# EasyEDA Pro project AIR32_minimal_system.eprj

# Schematic Schematic1
Create Date: 2023-08-29; Page Name: P1; Project Name: AIR32_minimal_system; Schematic Name: Schematic1; Update Date: 2023-09-01; Company: 嘉立创EDA; Page Size: A4; Version: V1.0
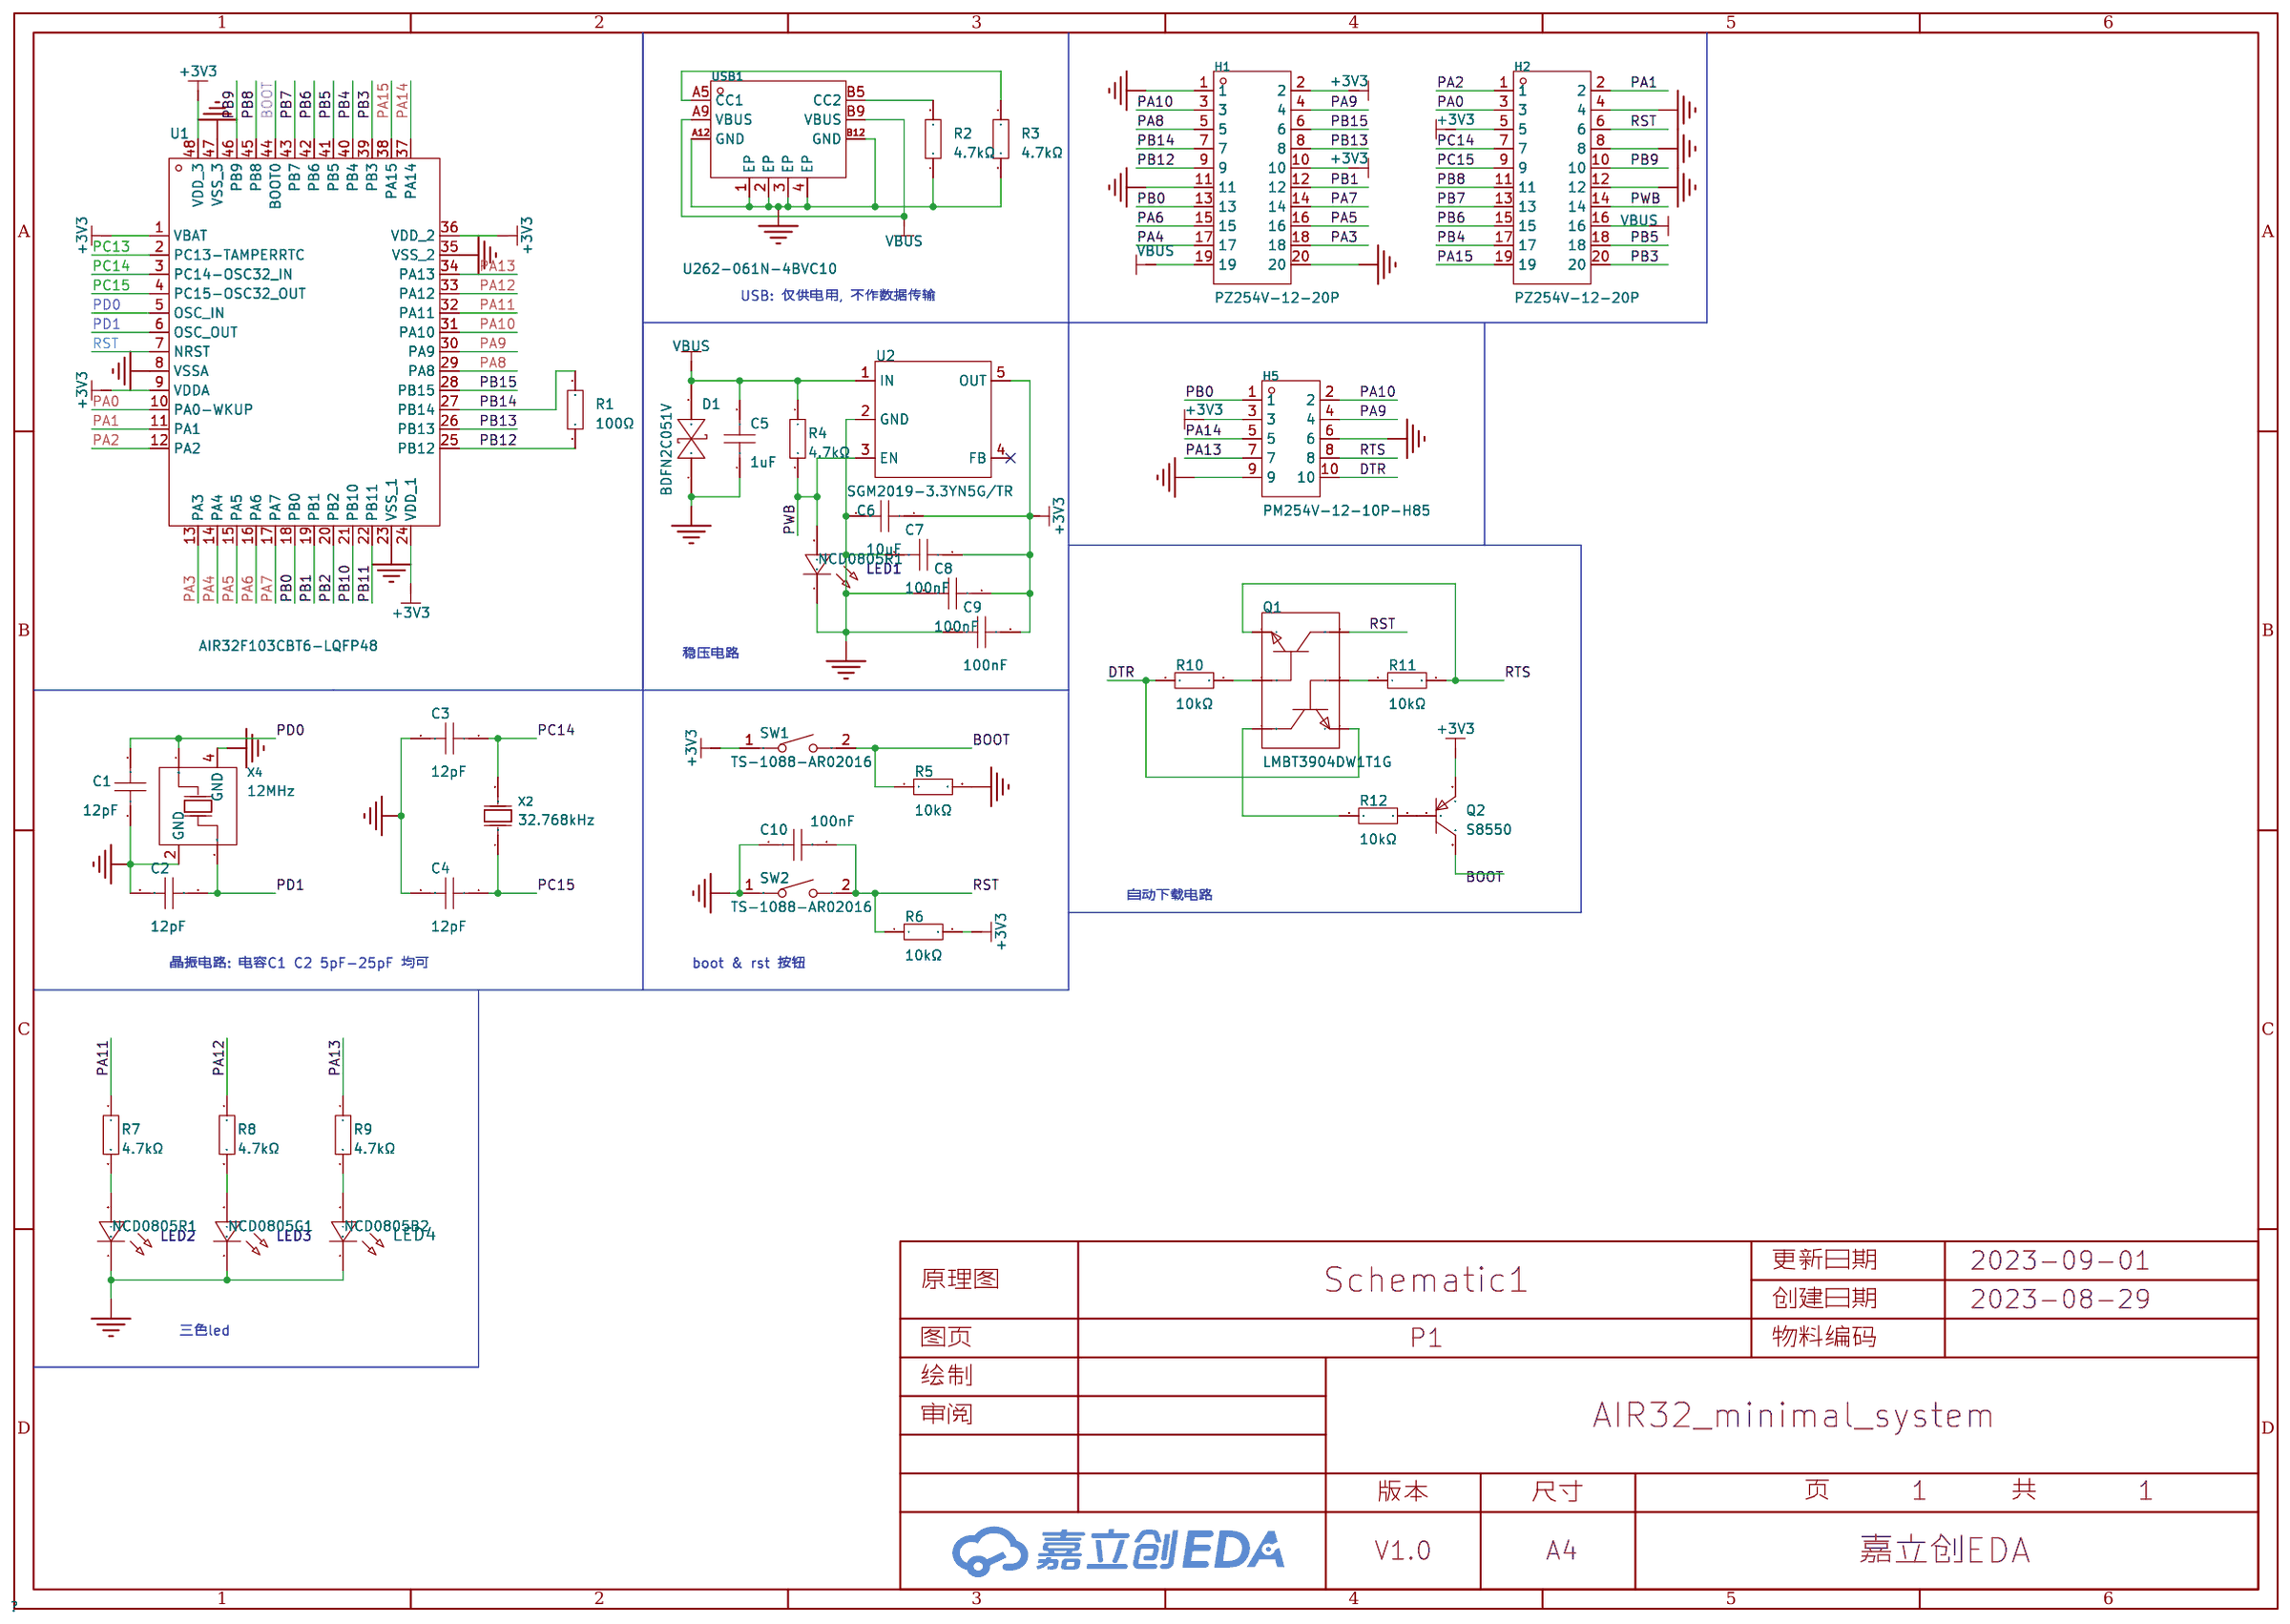
[diagram p0: schematic sheet]

## Parts
C1  12pF  [C0603]
C2  12pF  [C0603]
C3  12pF  [C0603]
C4  12pF  [C0603]
C5  1uF  [C0603]
C6  10uF  [C0603]
C7  100nF  [C0603]
C8  100nF  [C0603]
C9  100nF  [C0603]
C10  100nF  [C0603]
D1  BDFN2C051V  [X1SON-2_L1.0-W0.6-P0.65-BI]
H1  PZ254V-12-20P  [HDR-TH_20P-P2.54-V-M-R2-C10-S2.54]
H2  PZ254V-12-20P  [HDR-TH_20P-P2.54-V-M-R2-C10-S2.54]
H5  PM254V-12-10P-H85  [HDR-TH_10P-P2.54-V-F-R2-C5-S2.54]
LED1  NCD0805R1  [LED0805-RD_RED]
LED2  NCD0805R1  [LED0805-RD_RED]
LED3  NCD0805G1  [LED0805-R-RD]
LED4  NCD0805B2  [LED0805-R-RD]
Q1  LMBT3904DW1T1G  [SOT-363_L2.0-W1.3-P0.65-LS2.1-BR]
Q2  S8550  [SOT-23-3_L2.9-W1.6-P1.90-LS2.8-BR]
R1  100Ω  [R0603]
R2  4.7kΩ  [R0402]
R3  4.7kΩ  [R0402]
R4  4.7kΩ  [R0402]
R5  10kΩ  [R0402]
R6  10kΩ  [R0402]
R7  4.7kΩ  [R0402]
R8  4.7kΩ  [R0402]
R9  4.7kΩ  [R0402]
R10  10kΩ  [R0402]
R11  10kΩ  [R0402]
R12  10kΩ  [R0402]
SW1  TS-1088-AR02016  [SW-SMD_L3.9-W3.0-P4.45]
SW2  TS-1088-AR02016  [SW-SMD_L3.9-W3.0-P4.45]
U1  AIR32F103CBT6-LQFP48  [LQFP-48_L7.0-W7.0-P0.50-LS9.0-BL]
U2  SGM2019-3.3YN5G/TR  [SOT-23-5_L3.0-W1.7-P0.95-LS2.8-BR]
USB1  U262-061N-4BVC10  [TYPE-C-SMD_TYPE-C-31-M-16]
X2  32.768kHz  [CRYSTAL-SMD_L3.2-W1.5-1]
X4  12MHz  [CRYSTAL-SMD_4P-L3.2-W2.5-BL]

## Library data of the parts
C1-C4 = CL10C120JB8NNNC: 容值:12pF;精度:±5%;额定电压:50V;材质(温度系数):C0G;; LCSC Part Name: 12pF ±5% 50V; Supplier Part: C38523; Manufacturer: SAMSUNG(三星); Supplier Footprint: 0603; JLCPCB Part Class: Basic Part; Datasheet: https://atta.szlcsc.com/upload/public/pdf/source/20160218/1457707763339.pdf; Supplier: LCSC; Tolerance: ±5%; Voltage Rated: 50V; Temperature Coefficient: C0G
C5 = CL10A105KB8NNNC: 容值:1uF;精度:±10%;额定电压:50V;材质(温度系数):X5R;; LCSC Part Name: 1uF ±10% 50V; Supplier Part: C15849; Manufacturer: SAMSUNG(三星); Supplier Footprint: 0603; JLCPCB Part Class: Basic Part; Datasheet: https://atta.szlcsc.com/upload/public/pdf/source/20160103/1457707679084.pdf; Supplier: LCSC; Tolerance: ±10%; Voltage Rated: 50V; Temperature Coefficient: X5R
C6 = CL10A106KP8NNNC: 容值:10uF;精度:±10%;额定电压:10V;材质(温度系数):X5R;; LCSC Part Name: 10uF ±10% 10V; Supplier Part: C19702; Manufacturer: SAMSUNG(三星); Supplier Footprint: 0603; JLCPCB Part Class: Basic Part; Datasheet: https://atta.szlcsc.com/upload/public/pdf/source/20160103/1457707703378.pdf; Supplier: LCSC; Tolerance: ±10%; Voltage Rated: 10V; Temperature Coefficient: X5R
C7-C10 = CC0603KRX7R9BB104: 容值:100nF;精度:±10%;额定电压:50V;材质(温度系数):X7R;; LCSC Part Name: 100nF ±10% 50V; Supplier Part: C14663; Manufacturer: YAGEO(国巨); Supplier Footprint: 0603; JLCPCB Part Class: Basic Part; Datasheet: https://atta.szlcsc.com/upload/public/pdf/source/20180910/C282072_33301C7F631E79921B82A8DAC6BCC5B3.pdf; Supplier: LCSC; Tolerance: ±10%; Voltage Rated: 50V; Temperature Coefficient: X7R
D1 = BDFN2C051V: 极性:双向;反向截止电压(Vrwm):5V@Max;击穿电压:6V;峰值脉冲电流(Ipp)@10/1000μs:5.5A@8/20us;最大钳位电压:17V;; LCSC Part Name: 双向 Vrwm:5V@Max; Supplier Part: C152024; Manufacturer: BORN(伯恩半导体); Supplier Footprint: X1-SON-2(0.6x1); Datasheet: https://atta.szlcsc.com/upload/public/pdf/source/20180207/C152024_15179949141351359123.pdf; Supplier: LCSC; Polarity: 双向; Reverse Stand-Off Voltage (Vrwm): 5V@Max; Breakdown Voltage: 6V; Peak Pulse Current (Ipp)@10/1000μs: 5.5A@8/20us; Maximum Clamping Voltage: 17V
H1 H2 = PZ254V-12-20P: 排数:双排;总PIN位数:20;间距:2.54mm;插针结构:2x10P;行距:2.54mm;安装类型:直插;圆针/方针:方针;额定电流:-;额定电压:-;配合针长度:6mm;塑高:2.5mm;端接针长度:3mm;触头材质:黄铜;触头镀层:-;工作温度范围:-40℃~+105℃;颜色:黑色;; LCSC Part Name: 2.54mm 2x10P 直插 方针; Supplier Part: C492427; Manufacturer: XFCN(兴飞); Supplier Footprint: 直插,P=2.54mm; JLCPCB Part Class: 扩展库; Supplier: LCSC; Number of Rows: 双排; Number of Pins: 20; Pitch: 2.54mm; Pin Structure: 2x10P; Row Spacing: 2.54mm; Mounting Type: 直插; Circluar Pins/Square Pins: 方针; Length of Mating Pin: 6mm; Insulation Height: 2.5mm; Length of End Connection Pin: 3mm; Contact Material: 黄铜; Operating Temperature Range: -40℃~+105℃; Color: 黑色
H5 = PM254V-12-10P-H85: 排数:双排;总孔位数:10;间距:2.54mm;插孔结构:2x5P;行距:2.54mm;安装类型:直插;塑高:-;触头材质:黄铜;触头镀层:-;; LCSC Part Name: 2.54mm 2x5P; Supplier Part: C492399; Manufacturer: XFCN(兴飞); Supplier Footprint: 插件,P=2.54mm; JLCPCB Part Class: 扩展库; Supplier: LCSC; Number of Rows: 双排; Number of Holes: 10; Pitch: 2.54mm; Holes Structure: 2x5P; Row Spacing: 2.54mm; Mounting Type: 直插; Contact Material: 黄铜
LED1 LED2 = NCD0805R1: 发光颜色:红灯;; LCSC Part Name: 红灯; Supplier Part: C84256; Manufacturer: 国星光电; Supplier Footprint: 0805; JLCPCB Part Class: Basic Part; Datasheet: https://atta.szlcsc.com/upload/public/pdf/source/20200820/C84256_F0A75A43B3EAD75808600A0514C76B99.pdf; Supplier: LCSC; Emitted Color: 红灯; Lens Color: 无色透明; Dominant Wavelength: 465nm~475nm; Peak Wavelength: 468nm; Forward Current: 20mA; Power Dissipation: 76mW; Viewing Angle: 130°; Operating Temperature: -20℃~+80℃
LED3 = NCD0805G1: 发光颜色:翠绿;; LCSC Part Name: 翠绿; Supplier Part: C84260; Manufacturer: 国星光电; Supplier Footprint: 0805; JLCPCB Part Class: Extended Part; Datasheet: https://atta.szlcsc.com/upload/public/pdf/source/20200820/C84260_AFC7BF57C6FBA034D182BB8D10A67EFE.pdf; Supplier: LCSC; Emitted Color: 翠绿
LED4 = NCD0805B2: 发光颜色:蓝灯;; LCSC Part Name: 蓝灯; Supplier Part: C84259; Manufacturer: 国星光电; Supplier Footprint: 0805; JLCPCB Part Class: Extended Part; Datasheet: https://atta.szlcsc.com/upload/public/pdf/source/20200820/C84259_E5AC6865415989C4C2C2831134BA3A23.pdf; Supplier: LCSC; Emitted Color: 蓝灯
Q1 = LMBT3904DW1T1G: 晶体管类型:2个NPN;集射极击穿电压(Vceo):40V;集电极电流(Ic):200mA;功率(Pd):150mW;集电极截止电流(Icbo):-;集电极-发射极饱和电压(VCE(sat)@Ic,Ib):300mV@50mA,5mA;直流电流增益(hFE@Ic,Vce):100@10mA,1V;特征频率(fT):300MHz;工作温度:-55℃~+150℃@(Tj);; LCSC Part Name: 2个NPN 40V 200mA; Supplier Part: C131781; Manufacturer: LRC(乐山无线电); Supplier Footprint: SC-88; JLCPCB Part Class: 扩展库; Datasheet: https://atta.szlcsc.com/upload/public/pdf/source/20170918/C131781_1505703476125975491.pdf; Supplier: LCSC; Transistor Type: 2个NPN; Collector-Emitter Breakdown Voltage (Vceo): 40V; Collector Current (Ic): 200mA; Power Dissipation (Pd): 150mW; Collector-Emitter Saturation Voltage (VCE(sat)@Ic,Ib): 300mV@50mA,5mA; DC Current Gain (hFE@Ic,Vce): 100@10mA,1V; Transition Frequency (fT): 300MHz; Operating Temperature: -55℃~+150℃@(Tj)
Q2 = S8550_C105432: 晶体管类型:PNP;集射极击穿电压(Vceo):25V;集电极电流(Ic):500mA;功率(Pd):300mW;直流电流增益(hFE@Ic,Vce):120@50mA,1V;; LCSC Part Name: PNP 25V 500mA L档120-200; Supplier Part: C105432; Manufacturer: CJ(江苏长电/长晶); Supplier Footprint: SOT-23; JLCPCB Part Class: 基础库; Datasheet: https://atta.szlcsc.com/upload/public/pdf/source/20170413/1492062713649.pdf; Supplier: LCSC; Transistor Type: PNP; Collector-Emitter Breakdown Voltage (Vceo): 25V; Collector Current (Ic): 500mA; Power Dissipation (Pd): 300mW; Collector Cut-Off Current (Icbo): 100nA; Collector-Emitter Saturation Voltage (VCE(sat)@Ic,Ib): 600mV@500mA,50mA; DC Current Gain (hFE@Ic,Vce): 120@50mA,1V; Transition Frequency (fT): 150MHz; Operating Temperature: +150℃@(Tj)
R1 = 0603WAF1000T5E: 电阻类型:厚膜电阻;阻值:100Ω;精度:±1%;功率:100mW;; LCSC Part Name: 100Ω ±1% 100mW; Supplier Part: C22775; Manufacturer: UNI-ROYAL(厚声); Supplier Footprint: 0603; JLCPCB Part Class: Basic Part; Datasheet: https://atta.szlcsc.com/upload/public/pdf/source/20200306/C422600_1E6D84923E4A46A82E41ADD87F860B5C.pdf; Supplier: LCSC; Type: 厚膜电阻; Tolerance: ±1%; Power(Watts): 100mW; Temperature Coefficient: ±200ppm/℃; Overload Voltage (Max): 75V; Operating Temperature Range: -55℃~+155℃
R2-R4 R7-R9 = 0402WGF4701TCE: 电阻类型:厚膜电阻;阻值:4.7kΩ;精度:±1%;功率:62.5mW;; LCSC Part Name: 4.7kΩ ±1% 62.5mW; Supplier Part: C25900; Manufacturer: UNI-ROYAL(厚声); Supplier Footprint: 0402; JLCPCB Part Class: Basic Part; Datasheet: https://atta.szlcsc.com/upload/public/pdf/source/20200306/C422600_1E6D84923E4A46A82E41ADD87F860B5C.pdf; Supplier: LCSC; Type: 厚膜电阻; Tolerance: ±1%; Power(Watts): 62.5mW; Temperature Coefficient: ±100ppm/℃; Overload Voltage (Max): 50V; Operating Temperature Range: -55℃~+155℃
R5 R6 R10-R12 = 0402WGF1002TCE: 电阻类型:厚膜电阻;阻值:10kΩ;精度:±1%;功率:62.5mW;; LCSC Part Name: 10kΩ ±1% 62.5mW; Supplier Part: C25744; Manufacturer: UNI-ROYAL(厚声); Supplier Footprint: 0402; JLCPCB Part Class: Basic Part; Datasheet: https://atta.szlcsc.com/upload/public/pdf/source/20200306/C422600_1E6D84923E4A46A82E41ADD87F860B5C.pdf; Supplier: LCSC; Type: 厚膜电阻; Tolerance: ±1%; Power(Watts): 62.5mW; Temperature Coefficient: ±100ppm/℃; Overload Voltage (Max): 50V; Operating Temperature Range: -55℃~+155℃
SW1 SW2 = TS-1088-AR02016: 触点电流:50mA;额定电压(DC):12V;绝缘电阻:100MΩ;电路结构:单刀单掷;安装方式:立贴;作用力:160gf@±50gf;机械寿命:10万次;带支架:否;; LCSC Part Name: 4*3*2mm 立贴 轻触开关; Supplier Part: C720477; Manufacturer: XUNPU(讯普); Supplier Footprint: SMD; Datasheet: https://atta.szlcsc.com/upload/public/pdf/source/20200810/C720475_60D09DD6C54279ADDB2DC25100F1CC11.pdf; Supplier: LCSC; Contact Current: 50mA; Voltage Rating (DC): 12V; Insulation Resistance: 100MΩ; Circuit: 单刀单掷; Mounting Style: 立贴; Actuator Style: 圆形按钮; Actuator/Cap Color: 黑色; Operating Force: 160gf@±50gf; Mechanical Life: 10万次; Operating Temperature: -30℃~+80℃; Pin Style: SMD接片; Switch Length: 4mm; Switch Width: 3mm; Switch Height: 2mm; Strike Gundam: 否
U1 = AIR32F103CBT6-LQFP48: Supplier Part: C9900021638; Supplier Footprint: LQFP-48; JLCPCB Part Class: 扩展库; Datasheet: https://atta.szlcsc.comnull; Supplier: LCSC
U2 = SGM2019-3.3YN5G/TR: 输出类型:固定;输出极性:正;最大输入电压:5.5V;输出电压:3.3V;输出电流:300mA;电源纹波抑制比(PSRR):74dB@(1kHz);; LCSC Part Name: 输入5.5V 输出3.3V 300mA; Supplier Part: C23613; Manufacturer: SGMICRO(圣邦微); Supplier Footprint: SOT-23-5; Datasheet: https://atta.szlcsc.com/upload/public/pdf/source/20140228/1457706997483.pdf; Supplier: LCSC; Output Type: 固定; Output Polarity: 正; Number of Outputs: 1; Maximum Input Voltage: 5.5V; Output Voltage: 3.3V; Dropout Voltage: 400mV@(300mA); Output Current: 300mA; Power Supply Rejection Ratio (PSRR): 74dB@(1kHz)
USB1 = U262-061N-4BVC10: 连接器类型:Type-C;标准:USB 3.1;公母:母座;触点数量:6;端口数量:1;安装方式:卧贴;额定电流 - 电源:5A;触头材质:铜合金;触头镀层:金;工作温度范围:-25℃~+85℃;焊接温度(最大值):260℃;; LCSC Part Name: Type-C 母座 卧贴; Supplier Part: C692420; Manufacturer: XKB Connectivity(中国星坤); Supplier Footprint: SMD; Supplier: LCSC; Connector Type: Type-C; Standard: USB 3.1; Gender: 母座; Number of Contacts: 6; Number of Ports: 1; Mounting Style: 卧贴; Current Rating - Power (Max): 5A; Contact Material: 铜合金; Contact Plating: 金; Operating Temperature Range: -25℃~+85℃; Welding Temperature (Max): 260℃
X2 = XKXGI-SUA-32.768K: 频率:32.768kHz;频率公差:±20ppm;负载电容:12.5pF;; LCSC Part Name: 32.768kHz ±20ppm 12.5pF YST310S; Supplier Part: C5213671; Manufacturer: YXC(扬兴晶振); Supplier Footprint: SMD3215-2P; JLCPCB Part Class: 扩展库; Datasheet: https://atta.szlcsc.com/upload/public/pdf/source/20221026/C961783E7D3E186CA8CEB40DFC46D85F.pdf; Supplier: LCSC; Crystal Type: 贴片无源晶振; Frequency Tolerance: ±20ppm; Load Capacitance: 12.5pF
X4 = 7V12000005: 频率:12MHz;频率公差:±10ppm;负载电容:10pF;; LCSC Part Name: 12MHz ±10ppm 10pF; Supplier Part: C337203; Manufacturer: TXC(晶技); Supplier Footprint: SMD3225-4P; Datasheet: https://atta.szlcsc.com/upload/public/pdf/source/20190109/C337203_CAD2DA5F989B58A490C426B4EEAD14E1.pdf; Supplier: LCSC; Crystal Type: 贴片无源晶振; Frequency Tolerance: ±10ppm; Frequency Stability: ±10ppm; Load Capacitance: 10pF; Equivalent Series Resistance (ESR): 80Ω; Operating Temperature: -10℃~+70℃

## Nets
+3V3: C6.1 C7.1 C8.1 C9.1 H1.2 H1.10 H2.5 H5.3 Q2.2 SW1.1 U1.1(VBAT) U1.9(VDDA) U1.24(VDD_1) U1.36(VDD_2) U1.48(VDD_3) U2.5(OUT)
GND: C1.1 C2.2 C3.2 C4.2 C5.1 C6.2 C7.2 C8.2 C9.2 C10.1 D1.1 H1.1 H1.11 H1.20 H2.4 H2.8 H2.12 H5.6 H5.9 LED1.1(C) LED2.1(C) LED3.1(C) LED4.1(C) R2.1 R3.2 SW2.1 U1.8(VSSA) U1.23(VSS_1) U1.35(VSS_2) U1.47(VSS_3) U2.2(GND) USB1.1(EP) USB1.2(EP) USB1.3(EP) USB1.4(EP) USB1.A12(GND) USB1.B12(GND) X4.2(GND) X4.4(GND)
VBUS: C5.2 D1.2 H1.19 H2.16 R4.1 U2.1(IN) USB1.A9(VBUS) USB1.B9(VBUS)
BOOT: Q2.3 R5.1 SW1.2 U1.44(BOOT0)
DTR: H5.10 Q1.4(E) R10.1
PA0: H2.3 U1.10(PA0-WKUP)
PA1: H2.2 U1.11(PA1)
PA2: H2.1 U1.12(PA2)
PA3: H1.18 U1.13(PA3)
PA4: H1.17 U1.14(PA4)
PA5: H1.16 U1.15(PA5)
PA6: H1.15 U1.16(PA6)
PA7: H1.14 U1.17(PA7)
PA8: H1.5 U1.29(PA8)
PA9: H1.4 H5.4 U1.30(PA9)
PA10: H1.3 H5.2 U1.31(PA10)
PA11: R7.1 U1.32(PA11)
PA12: R8.1 U1.33(PA12)
PA13: H5.7 R9.1 U1.34(PA13)
PA14: H5.5 U1.37(PA14)
PA15: H2.19 U1.38(PA15)
PB0: H1.13 H5.1 U1.18(PB0)
PB1: H1.12 U1.19(PB1)
PB2: U1.20(PB2)
PB3: H2.20 U1.39(PB3)
PB4: H2.17 U1.40(PB4)
PB5: H2.18 U1.41(PB5)
PB6: H2.15 U1.42(PB6)
PB7: H2.13 U1.43(PB7)
PB8: H2.11 U1.45(PB8)
PB9: H2.10 U1.46(PB9)
PB10: U1.21(PB10)
PB11: U1.22(PB11)
PB12: H1.9 R1.1 U1.25(PB12)
PB13: H1.8 U1.26(PB13)
PB14: H1.7 R1.2 U1.27(PB14)
PB15: H1.6 U1.28(PB15)
PC13: U1.2(PC13-TAMPERRTC)
PC14: C3.1 H2.7 U1.3(PC14-OSC32_IN) X2.2(OSC2)
PC15: C4.1 H2.9 U1.4(PC15-OSC32_OUT) X2.1(OSC1)
PD0: C1.2 U1.5(OSC_IN) X4.1(OSC1)
PD1: C2.1 U1.6(OSC_OUT) X4.3(OSC2)
PWB: H2.14 LED1.2(A) R4.2 U2.3(EN)
RST: C10.2 H2.6 Q1.6(C) R6.1 SW2.2 U1.7(NRST)
RTS: H5.8 Q1.1(E) R11.2
$1N3639: R2.2 USB1.B5(CC2)
$1N3648: R3.1 USB1.A5(CC1)
$1N5130: LED2.2(A) R7.2
$1N5133: LED3.2(A) R8.2
$1N5139: LED4.2(A) R9.2
$1N8280: Q1.2(B) R10.2
$1N8313: Q1.5(B) R11.1
$1N8402: Q1.3(C) R12.1
$1N8538: Q2.1 R12.2

Not connected (* = marked no-connect by the designer): R5 2; R6 2; U2 4(FB)*

## Notes on the sheet
- USB: 仅供电用, 不作数据传输
- 稳压电路
- 自动下载电路
- 晶振电路: 电容C1 C2 5pF-25pF 均可
- boot & rst 按钮
- 三色led

# Board PCB1
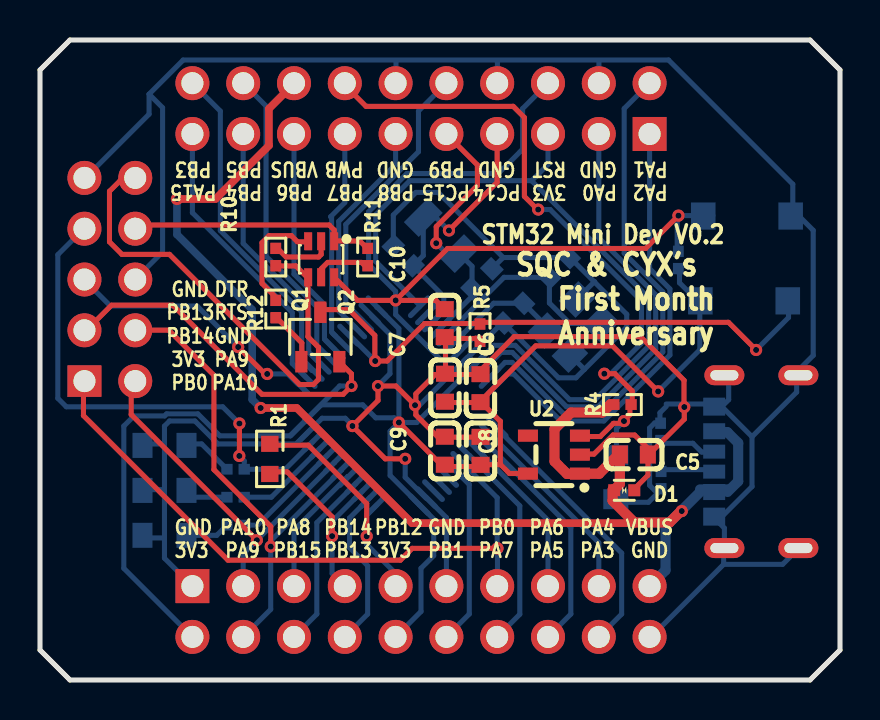
[diagram p1: board, top side]
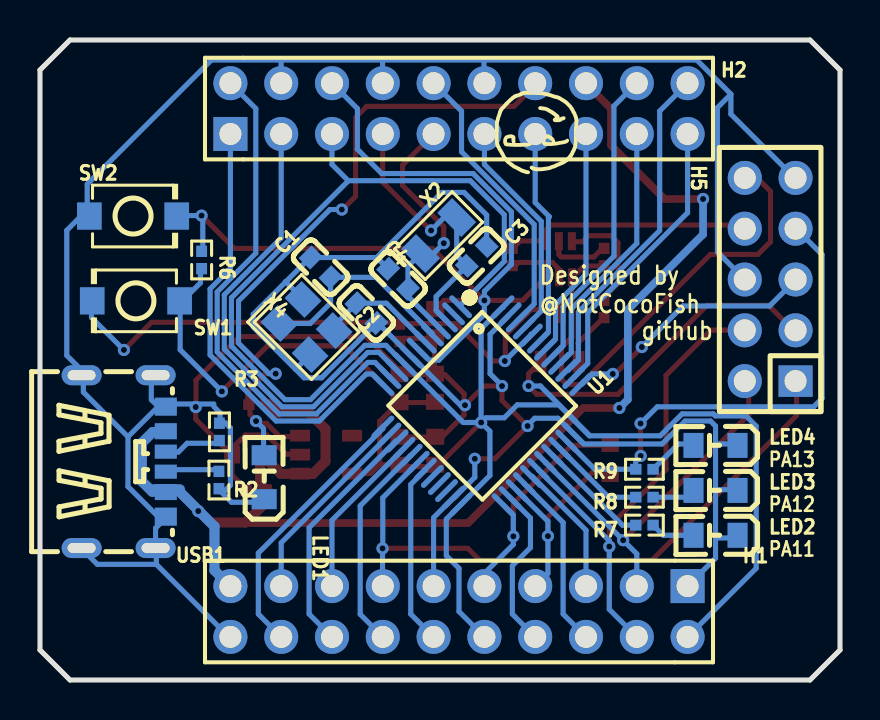
[diagram p2: board, bottom side, seen from below]

Outline 40 x 32 mm; copper layers: Top Layer, Bottom Layer. Coordinates in mm from the lower left corner of the outline.
Outline path: 0,30.5 0,1.5 1.5,0 38.5,0 40,1.5 40,30.5 38.5,32 1.5,32 0,30.5
Stack: Top Layer 0.035mm / Dielectric1 1.51mm FR4 er 4.5 / Bottom Layer 0.035mm

## Design rules (mm)
template: 自定义配置
spacing copperThickness1oz (default): track to track 0.102, other pairs 0.152 to 0.3
spacing copperThickness2oz: track to track 0.203, other pairs 0.152 to 0.3
track width copperThickness1oz (default): min 0.254, default 0.254, max 0.762
track width copperThickness2oz: min 0.203, default 0.254, max 2.54
track width VCC and GND: min 0.254, default 0.381, max 0.762
differential pair differentialPair (default): width min 0.127, default 0.254, max 2.54; gap min 0.152, default 0.152
via viaSize (default): diameter min 0.5, default 0.61, max 10; hole min 0.3, default 0.305, max 6.299
net VBUS uses VCC and GND

## Placement (name value [footprint] x y rotation side)
C1  12pF  [C0603]  25.97 20.63 225 bottom
C2  12pF  [C0603]  23.68 18.34 225 bottom
C3  12pF  [C0603]  18.16 21.2 135 bottom
C4  12pF  [C0603]  22.1 20.06 45 bottom
C5  1uF  [C0603]  29.69 11.27 180 top
C6  10uF  [C0603]  22.03 14.59 90 top
C7  100nF  [C0603]  20.25 14.62 90 top
C8  100nF  [C0603]  22.03 11.46 90 top
C9  100nF  [C0603]  20.24 11.46 90 top
C10  100nF  [C0603]  20.24 17.84 90 top
D1  BDFN2C051V  [X1SON-2_L1.0-W0.6-P0.65-BI]  29.21 9.49 180 top
H1  PZ254V-12-20P  [HDR-TH_20P-P2.54-V-M-R2-C10-S2.54]  19.05 3.42 0 bottom
H2  PZ254V-12-20P  [HDR-TH_20P-P2.54-V-M-R2-C10-S2.54]  19.05 28.57 180 bottom
H5  PM254V-12-10P-H85  [HDR-TH_10P-P2.54-V-F-R2-C5-S2.54]  3.49 20.02 90 bottom
LED1  NCD0805R1  [LED0805-RD_RED]  28.79 10.14 90 bottom
LED2  NCD0805R1  [LED0805-RD_RED]  6.22 7.23 0 bottom
LED3  NCD0805G1  [LED0805-RD_RED]  6.22 9.48 0 bottom
LED4  NCD0805B2  [LED0805-RD_RED]  6.22 11.73 0 bottom
Q1  LMBT3904DW1T1G  [SOT-363_L2.0-W1.3-P0.65-LS2.1-BR]  14.06 21.04 90 top
Q2  S8550  [SOT-23-3_L2.9-W1.6-P1.90-LS2.8-BR]  14.02 17.15 270 top
R1  100Ω  [R0603]  11.49 11.06 270 top
R2  4.7kΩ  [R0402]  31.05 10 90 bottom
R3  4.7kΩ  [R0402]  31.03 12.41 90 bottom
R4  4.7kΩ  [R0402]  29.12 13.77 0 top
R5  10kΩ  [R0402]  22 17.37 270 top
R6  10kΩ  [R0402]  31.92 21 270 bottom
R7  4.7kΩ  [R0402]  9.78 7.74 180 bottom
R8  4.7kΩ  [R0402]  9.78 9.14 180 bottom
R9  4.7kΩ  [R0402]  9.78 10.54 180 bottom
R10  10kΩ  [R0402]  11.79 21.15 90 top
R11  10kΩ  [R0402]  16.38 21.15 90 top
R12  10kΩ  [R0402]  11.79 18.55 270 top
SW1  TS-1088-AR02016  [SW-SMD_L3.9-W3.0-P4.45]  35.2 18.96 0 bottom
SW2  TS-1088-AR02016  [SW-SMD_L3.9-W3.0-P4.45]  35.35 23.2 180 bottom
U1  AIR32F103CBT6-LQFP48  [LQFP-48_L7.0-W7.0-P0.50-LS9.0-BL]  17.91 13.71 315 bottom
U2  SGM2019-3.3YN5G/TR  [SOT-23-5_L3.0-W1.7-P0.95-LS2.8-BR]  25.7 11.27 0 top
USB1  U262-061N-4BVC10  [TYPE-C-SMD_TYPE-C-31-M-16]  35.81 10.92 270 bottom
X2  32.768kHz  [CRYSTAL-SMD_L3.2-W1.5-1]  20.07 22.22 135 bottom
X4  12MHz  [CRYSTAL-SMD_4P-L3.2-W2.5-BL]  26.67 17.65 225 bottom

## Footprints (pads in the part's own frame, mm; a bottom-side part is the same pattern mirrored in y, then rotated)
C0603
  rect 0.8x0.9 smd: 1(-0.7,0) 2(0.7,0)
CRYSTAL-SMD_4P-L3.2-W2.5-BL
  rect 1.4x1.2 smd: 1(-1.1,-0.85) 2(1.1,-0.85) 3(1.1,0.85) 4(-1.1,0.85)
CRYSTAL-SMD_L3.2-W1.5-1
  rect 1.05x1.7 smd: 1(-1.275,0) 2(1.275,0)
HDR-TH_10P-P2.54-V-F-R2-C5-S2.54
  rect 1.575x1.7 hole 1.1: 1(-5.08,-1.27)
  round 1.7 hole 1.1: 2(-5.08,1.27) 3(-2.54,-1.27) 4(-2.54,1.27) 5(0,-1.27) 6(0,1.27) 7(2.54,-1.27) 8(2.54,1.27) 9(5.08,-1.27) 10(5.08,1.27)
HDR-TH_20P-P2.54-V-M-R2-C10-S2.54
  rect 1.7x1.7 hole 1.1: 1(-11.43,-1.27)
  round 1.7 hole 1.1: 2(-11.43,1.27) 3(-8.89,-1.27) 4(-8.89,1.27) 5(-6.35,-1.27) 6(-6.35,1.27) 7(-3.81,-1.27) 8(-3.81,1.27) 9(-1.27,-1.27) 10(-1.27,1.27) 11(1.27,-1.27) 12(1.27,1.27) 13(3.81,-1.27) 14(3.81,1.27) 15(6.35,-1.27) 16(6.35,1.27) 17(8.89,-1.27) 18(8.89,1.27) 19(11.43,-1.27) 20(11.43,1.27)
LED0805-RD_RED
  rect 1x1.25 smd: 1(-1.1,0) 2(1.1,0)
LQFP-48_L7.0-W7.0-P0.50-LS9.0-BL
  oval 0.27x1.5 smd: 1(-2.75,-4.25) 2(-2.25,-4.25) 3(-1.75,-4.25) 4(-1.25,-4.25) 5(-0.75,-4.25) 6(-0.25,-4.25) 7(0.25,-4.25) 8(0.75,-4.25) 9(1.25,-4.25) 10(1.75,-4.25) 11(2.25,-4.25) 12(2.75,-4.25) 25(2.75,4.25) 26(2.25,4.25) 27(1.75,4.25) 28(1.25,4.25) 29(0.75,4.25) 30(0.25,4.25) 31(-0.25,4.25) 32(-0.75,4.25) 33(-1.25,4.25) 34(-1.75,4.25) 35(-2.25,4.25) 36(-2.75,4.25)
  oval 1.5x0.27 smd: 13(4.25,-2.75) 14(4.25,-2.25) 15(4.25,-1.75) 16(4.25,-1.25) 17(4.25,-0.75) 18(4.25,-0.25) 19(4.25,0.25) 20(4.25,0.75) 21(4.25,1.25) 22(4.25,1.75) 23(4.25,2.25) 24(4.25,2.75) 37(-4.25,2.75) 38(-4.25,2.25) 39(-4.25,1.75) 40(-4.25,1.25) 41(-4.25,0.75) 42(-4.25,0.25) 43(-4.25,-0.25) 44(-4.25,-0.75) 45(-4.25,-1.25) 46(-4.25,-1.75) 47(-4.25,-2.25) 48(-4.25,-2.75)
R0402
  rect 0.566x0.54 smd: 1(-0.433,0) 2(0.433,0)
R0603
  rect 0.806x0.864 smd: 1(-0.753,0) 2(0.753,0)
SOT-23-3_L2.9-W1.6-P1.90-LS2.8-BR
  rect 1.07x0.6 smd: 1(1.235,-0.95) 2(1.235,0.95) 3(-1.235,0)
SOT-23-5_L3.0-W1.7-P0.95-LS2.8-BR
  rect 1x0.6 smd: 1(1.3,-0.95) 2(1.3,0) 3(1.3,0.95) 4(-1.3,0.95) 5(-1.3,-0.95)
SOT-363_L2.0-W1.3-P0.65-LS2.1-BR
  rect 0.9x0.4 smd: 1(0.9,-0.65) 2(0.9,0) 3(0.9,0.65) 4(-0.9,0.65) 5(-0.9,0) 6(-0.9,-0.65)
SW-SMD_L3.9-W3.0-P4.45
  rect 1.23x1.36 smd: 1(-2.185,0) 2(2.185,0)
TYPE-C-SMD_TYPE-C-31-M-16
  oval 1x2 hole 0.5x1.4: 1(-4.32,1.595) 2(4.32,1.595) 3(-4.32,-2.105) 4(4.32,-2.105)
  rect 0.7x1.1 smd: A5(-0.5,2.105) B5(0.5,2.105)
  rect 0.8x1.1 smd: A9(1.52,2.105) B9(-1.52,2.105)
  rect 0.9x1.1 smd: A12(2.75,2.105) B12(-2.75,2.105)
X1SON-2_L1.0-W0.6-P0.65-BI
  rect 0.6x0.6 smd: 1(-0.5,0) 2(0.5,0)

## Nets
As in the schematic, except:
+3V3: C6.1 C7.1 C8.1 C9.1 H1.2 H1.10 H2.5 H5.3 Q2.2 R6.2 SW1.1 U1.1 U1.9 U1.24 U1.36 U1.48 U2.5
GND: C1.1 C2.2 C3.2 C4.2 C5.1 C6.2 C7.2 C8.2 C9.2 C10.1 D1.1 H1.1 H1.11 H1.20 H2.4 H2.8 H2.12 H5.6 H5.9 LED1.1 LED2.1 LED3.1 LED4.1 R2.1 R3.2 R5.2 SW2.1 U1.8 U1.23 U1.35 U1.47 U2.2 USB1.1 USB1.2 USB1.3 USB1.4 USB1.A12 USB1.B12 X4.2 X4.4

Pads without a net: U2 4

## Via types
v1: diameter 0.61, hole 0.305, Top Layer to Bottom Layer, 29 vias

## Routing (per net, layer and track width the routed paths; a pad name or vN(x,y) marks a point on that pad's centre or on a via; arc(x,y) is an arc through that point)
+3V3: length 142.3
  Top Layer w0.254: 22.01,13.93 24.78,16.71 28.63,16.71 v1(30.91,14.43) ; 22.01,13.93 21.95,13.87 20.28,13.87 ; 22.01,13.93 23.01,12.94 23.02,12.94 23.02,10.78 ; 22.01,13.93 21.94,14 ; 22,10.77 23,10.77 23.02,10.78 ; 23.02,10.78 22.97,10.82 ; 23.02,10.78 23.47,10.33 24.39,10.33 ; 2.2,17.36 3.58,18.74 6.64,18.74 11.1,14.28 15.16,14.28 v1(15.57,14.7) 15.57,15.31 14.97,15.91 ; 17.94,12.88 20.15,10.67 22.17,10.67
  Bottom Layer w0.254: H2.5 25.4,25.78 24.59,24.97 ; 13.23,12.95 14.98,14.7 v1(15.57,14.7) ; H1.2 4.19,5.58 4.19,12.7 4.7,13.2 6.23,13.2 6.33,13.31 7.89,13.31 8.99,12.21 12.52,12.21 14.06,13.76 16.14,13.76 16.79,13.11 17.71,13.11 v1(17.94,12.88) ; v1(17.94,12.88) 17.94,17.57 16.87,18.64 16.84,18.64 ; v1(17.94,12.88) 17.51,12.44 17.51,10.22 U1.24 19.68,8.04 19.68,6.22 19.05,5.58 19.05,3.42 H1.10 ; v1(17.94,12.88) 18.84,12.88 U1.9 21.81,15.83 22.71,16.73 23.76,16.73 26.48,14.02 27.75,14.02 30.43,16.69 30.43,19.11 24.57,24.97 18.49,24.97 16.79,23.26 16.79,20.93 18.97,18.75 U1.1 ; v1(30.91,14.43) 32.99,16.51 32.99,18.84 ; 32.99,18.84 32.99,19.1 ; 32.99,18.84 31.97,19.86 31.97,20.52
GND: length 211.1
  Top Layer w0.254: v1(18.75,13.74) 17.79,14.7 v1(16.9,14.7) 16.9,13.98 v1(15.62,12.7) 17.26,11.06 v1(18.26,11.06) ; 21.78,15.24 21.82,15.27 ; 21.82,15.27 20.31,15.27 ; 21.82,15.27 22.06,15.27 ; 21.82,15.27 23.71,17.17 30.02,17.17 32.2,14.99 32.2,13.66 v1(32.21,13.65) 32.21,13.04 30.4,11.22 ; 27.01,11.28 27.03,11.3 27.7,11.3 28.65,12.25 29.73,12.25 30.4,11.58 30.4,11.22 ; 20,15.27 19.76,15.27 18.79,14.31 18.79,13.25 19.93,12.12 20.28,12.12 ; 20.3,15.37 20.28,15.39 20.28,17.08 21.77,17.08 21.96,16.89 ; 30.4,11.22 30.4,11.22 30.4,10.24 29.7,9.54 ; 20.22,12.14 21.97,12.14
  Bottom Layer w0.254: 31.02,9.48 30.42,8.89 28.77,8.89 ; 31.02,9.48 30.73,9.48 30.48,9.74 30.48,12.6 30.73,12.85 31,12.85 31,13.36 31.31,13.67 ; 31.02,9.48 31.07,9.48 ; 27.93,30.98 27.95,30.96 27.95,29.84 ; U1.23 20.32,8.12 H1.11 ; 37.64,23.26 37.64,24.79 31.43,31 7.15,31 ; 37.64,23.26 37.88,23.26 38.66,22.48 38.66,16.23 37.96,15.53 ; 37.64,23.26 37.52,23.26 ; v1(18.75,13.74) 18.98,13.74 21.35,16.11 ; v1(18.26,11.06) 18.26,10.13 19.31,9.09 ; 17.8,29.84 17.8,30.95 17.77,30.98 ; 27.74,19.91 27.72,19.91 27.71,19.91 ; H1.1 6.22,6.09 6.22,7.1 ; 5.45,29.29 5.45,28.29 2.15,24.99 ; 5.45,29.29 6.13,28.62 6.13,21.4 4.7,19.97 ; 5.45,29.29 7.16,30.99 ; 27.22,15.53 29.34,17.65 29.34,18.28 27.71,19.91 ; 27.22,15.53 26.8,15.11 25.92,15.11 C2.2 23.1,17.85 U1.8 ; 27.22,15.53 26.49,16.27 ; 27.71,19.91 26.5,21.12 23.16,21.12 ; 27.71,19.91 26.84,19.04 ; 16.58,18.2 17.5,17.28 17.5,15.32 16.9,14.72 v1(16.9,14.7) ; 34.09,13.67 34.43,14.02 34.43,14.78 34.43,14.79 ; 34.09,13.67 35.6,12.16 ; 34.09,13.67 34.03,13.67 ; 34.03,13.67 34.02,13.66 ; 34.03,13.67 33.77,13.67 33.77,13.8 31.31,13.8 ; 23.16,21.12 22.59,20.56 ; 23.16,21.12 19.91,24.38 18.8,24.38 17.67,23.25 C3.2 ; 22.86,30.96 22.87,30.95 22.87,29.85 ; 34.18,5.78 37.13,5.78 37.96,6.61 ; 34.18,5.78 30.53,2.14 ; 34.18,5.78 34.18,6.74 ; 37.83,15.25 37.83,14.39 35.6,12.16 ; 6.22,9.51 6.22,9.52 5.07,9.52 ; 6.22,9.51 6.22,11.8 ; 6.22,9.51 6.22,7.1 ; 5.07,11.8 6.22,11.8 ; 6.22,11.8 6.22,12.7 6.48,12.95 7.75,12.95 8.89,11.8 12.81,11.8 U1.35 14.1,13.09 15.26,13.09 15.62,12.73 v1(15.62,12.7) ; 35.6,12.16 35.6,9.67 34.05,8.12 33.69,8.12 34.22,7.59 34.22,6.55 ; 6.22,7.1 5.07,7.1
VBUS: length 69.6
  Top Layer w0.381: v1(6.85,24.05) 8.78,24.05 11.45,26.72 11.45,28.56 12.65,29.77 ; v1(11.03,13.6) 12.84,13.6 18.6,7.84 29.65,7.84 29.7,7.89 ; 31.48,7.88 31.49,7.88 ; 29.7,7.88 29.72,7.88
  Top Layer w0.508: 28.63,9.52 28.63,8.97 29.72,7.88 31.48,7.88 32.05,8.45 v1(32.09,8.45) ; 27.07,10.3 26.35,10.3 25.73,10.93 25.73,12.55 26.55,13.37 28.11,13.37 28.52,13.78 28.69,13.78 ; 26.94,10.31 27.96,10.31 28.97,11.33 28.99,11.33 28.99,9.8 28.71,9.51
  Bottom Layer w0.381: v1(6.85,24.05) 6.85,22.28 10.61,18.52 10.61,14.02 v1(11.03,13.6)
  Bottom Layer w0.508: 33.01,9.53 34.38,9.53 ; 34.38,9.4 34.91,9.94 34.91,11.85 34.37,12.39 33.65,12.39 ; 33.01,9.4 31.28,7.67 31.28,5.48 30.47,4.68
BOOT: length 30
  Top Layer w0.254: 21.99,17.82 19.23,17.82 17.35,15.95 v1(16.76,15.95) 16.74,15.97 16.74,17.23 15.45,18.52 13.96,18.52 ; v1(35.8,16.5) 34.42,17.88 21.98,17.88
  Bottom Layer w0.254: v1(16.76,15.95) 15.45,17.26 15.45,17.3 ; v1(35.8,16.5) 37.43,18.12 37.43,18.93
DTR: length 24.8
  Top Layer w0.254: 11.76,20.7 12.79,20.7 13.38,20.11 ; 13.4,20.16 13.4,17.16 13.92,16.64 13.92,15.03 13.67,14.77 12.98,14.77 6.47,21.28 4.1,21.28 3.47,21.91 3.47,24.44 4.16,25.13 4.72,25.13
PA0: length 23.3
  Bottom Layer w0.254: U1.10 23.05,16.38 23.61,16.38 26.33,13.66 27.9,13.66 30.78,16.55 30.78,19.26 27.94,22.1 H2.3
PA1: length 26.1
  Bottom Layer w0.254: 22.5,15.13 22.5,15.13 23.25,15.88 23.61,15.88 26.18,13.31 28.05,13.31 31.14,16.4 31.14,19.41 29.21,21.34 29.21,28.57 H2.2
PA2: length 22.7
  Bottom Layer w0.254: U1.12 23.38,15.3 23.69,15.3 26.03,12.95 28.19,12.95 31.5,16.25 31.5,19.55 30.48,20.57 H2.1
PA3: length 13.5
  Bottom Layer w0.254: U1.13 22.86,12.57 29.08,6.35 29.08,3.3 H1.18
PA4: length 9.9
  Bottom Layer w0.254: 22.5,12.3 27.94,6.86 H1.17
PA5: length 12.1
  Bottom Layer w0.254: 22.15,11.94 22.21,11.94 26.54,7.62 26.54,3.3 H1.16
PA6: length 8.4
  Bottom Layer w0.254: H1.15 25.4,7.99 U1.16
PA7: length 10.6
  Bottom Layer w0.254: H1.14 23.99,3.28 23.99,8.71 21.46,11.24 U1.17
PA8: length 6.6
  Bottom Layer w0.254: H1.5 12.7,7.49 15.39,10.18 U1.29
PA9: length 25
  Top Layer w0.254: 4.8,17.49 6.44,17.49 8.7,15.24 8.7,10.52 11.54,7.67 11.54,6.67
  Bottom Layer w0.254: U1.30 15.08,10.5 11.54,6.96 v1(11.54,6.67) 11.54,3.53 H1.4
PA10: length 18.6
  Top Layer w0.254: v1(10.84,6.99) 4.56,13.27 4.56,14.91
  Bottom Layer w0.254: U1.31 14.72,10.87 v1(10.84,6.99) 10.16,6.31 H1.3
PA11: length 5.6
  Bottom Layer w0.254: R7.1 10.88,7.74 U1.32
PA12: length 4.8
  Bottom Layer w0.254: U1.33 11.57,9.14 R8.1
PA13: length 25.1
  Top Layer w0.254: v1(9.97,12.82) 9.97,11.21 v1(9.97,11.2)
  Bottom Layer w0.254: 2.19,22.57 0.89,21.26 0.89,14.09 1.32,13.66 9.13,13.66 v1(9.97,12.82) ; 10.21,10.54 10.21,10.95 v1(9.97,11.2) ; 10.21,10.54 12.26,10.54 13.66,11.94 ; 10.21,10.54 10.21,10.49
PA14: length 12.8
  Top Layer w0.254: v1(9.91,16.65) 11.25,15.3 v1(11.36,15.3)
  Bottom Layer w0.254: v1(11.36,15.3) 12.39,15.3 12.9,14.79 ; v1(9.91,16.65) 7.86,18.7 3.52,18.7 2.22,20
PA15: length 14.5
  Bottom Layer w0.254: H2.19 7.62,23.36 12.61,18.37 12.61,15.82 U1.38
PB0: length 32.5
  Top Layer w0.254: v1(22.87,6.58) 18.61,6.58 18.02,5.99 9.4,5.99 2.17,13.22 2.17,14.82
  Bottom Layer w0.254: 21.09,10.88 22.86,9.11 22.86,6.6 v1(22.87,6.58) 22.87,4.71 22.85,4.69
PB1: length 9.1
  Bottom Layer w0.254: H1.12 21.46,3.3 21.46,9.78 20.74,10.5 U1.19
PB3: length 16.9
  Bottom Layer w0.254: H2.20 9.02,28.44 9.02,22.47 13.08,18.41 13.08,16 13.6,15.48 U1.39
PB4: length 13.1
  Bottom Layer w0.254: H2.17 10.16,21.83 13.44,18.55 13.44,16.38 13.98,15.83 U1.40
PB5: length 15.4
  Bottom Layer w0.254: U1.41 13.84,16.72 13.84,18.65 11.3,21.19 11.3,28.7 H2.18
PB6: length 11.6
  Bottom Layer w0.254: H2.15 12.7,20.3 14.22,18.77 14.22,17.04 U1.42
PB7: length 10.5
  Bottom Layer w0.254: 14.77,17.21 14.58,17.4 14.58,23.13 14.53,23.16 15.24,23.87 H2.13
PB8: length 11.2
  Bottom Layer w0.254: H2.11 17.78,25.78 14.93,22.93 14.93,18.45 U1.45
PB9: length 14.3
  Bottom Layer w0.254: H2.10 18.92,28.44 18.92,26.41 15.29,22.78 15.29,18.8 U1.46
PB12: length 12.5
  Top Layer w0.254: 11.56,11.74 13.41,11.74 16.33,8.82 v1(16.33,7.19)
  Bottom Layer w0.254: H1.9 17.78,5.33 16.33,6.78 v1(16.33,7.19) 16.33,8.25 U1.25
PB13: length 8.2
  Bottom Layer w0.254: H1.8 16.38,3.3 16.38,5.71 15.48,6.62 15.48,8.1 U1.26
PB14: length 10.8
  Top Layer w0.254: v1(14.6,7.19) 14.6,8.16 12.36,10.41 11.5,10.41 11.42,10.33
  Bottom Layer w0.254: H1.7 14.6,5.33 v1(14.6,7.19) 14.6,7.94 U1.27
PB15: length 8.9
  Bottom Layer w0.254: U1.28 15.79,9.81 13.84,7.87 13.84,3.3 H1.6
PC14: length 13.6
  Top Layer w0.254: v1(20.45,22.48) 22.86,24.89 H2.7
  Bottom Layer w0.254: U1.3 20.19,18.47 20.19,19.17 C3.1 19.16,21.22 X2.2 19.8,23.12 v1(20.45,22.48)
PC15: length 13
  Top Layer w0.254: v1(19.81,21.84) 19.81,22.67 21.87,24.73 21.87,25.75 H2.9
  Bottom Layer w0.254: U1.4 20.03,17.61 21.6,19.19 21.6,20.68 X2.1 20.33,21.32 v1(19.81,21.84)
PD0: length 10.6
  Bottom Layer w0.254: 28.05,17.83 26.49,17.83 25.47,18.85 25.47,20.13 23.2,20.13 20.38,17.31 U1.5
PD1: length 6.1
  Bottom Layer w0.254: 20.74,16.89 22.68,18.84 C2.1 25.29,17.72 25.29,17.47
PWB: length 34.2
  Top Layer w0.254: v1(24.91,23.52) 24.88,23.52 24.22,24.18 24.22,28.12 23.66,28.68 16.3,28.68 15.18,29.8 ; 27,12.17 28.01,12.17 28.67,12.83 29.06,12.83 29.5,13.27 29.5,13.67 29.61,13.78 29.61,14.45 28.74,15.31 v1(28.22,15.31)
  Bottom Layer w0.254: v1(29.2,12.95) 28.82,12.57 28.82,11.12 ; v1(28.22,15.31) 28.55,15.31 30.07,16.84 30.07,18.95 25.51,23.52 v1(24.91,23.52)
RST: length 48.6
  Top Layer w0.254: 14.8,20.05 15.87,18.98 v1(17.78,18.98) ; v1(31.92,23.22) 30.28,21.58 20.38,21.58 v1(17.78,18.98) ; v1(17.78,18.98) 19.8,18.98 20.3,18.48
  Bottom Layer w0.254: 21.09,16.54 20.55,16 20.05,16 17.78,18.27 v1(17.78,18.98) 17.78,18.98 17.78,19.43 16.43,20.78 16.43,23.41 18.34,25.32 22.91,25.32 24.13,26.54 24.13,28.57 H2.6 ; 33.64,23.22 v1(31.92,23.22) 31.86,23.16 31.86,21.42
RTS: length 12.5
  Top Layer w0.254: 14.71,21.95 14.71,22.5 14.46,22.75 4.98,22.75 4.72,22.5 ; 14.71,21.95 14.69,21.95 ; 14.71,21.95 15.99,21.95 16.34,21.6
$1N3639: length 2.6
  Bottom Layer w0.254: 33.68,10.41 33.58,10.52 31.15,10.52
$1N3648: length 2.8
  Bottom Layer w0.254: 31.09,11.84 32.64,11.84 33.08,11.4 33.76,11.4
$1N5130: length 2.3
  Bottom Layer w0.254: R7.2 8.84,7.23 7.28,7.23 7.27,7.23
$1N5133: length 2.2
  Bottom Layer w0.254: R8.2 7.65,9.14 7.27,9.52
$1N5139: length 2.6
  Bottom Layer w0.254: R9.2 8.08,11.8 7.27,11.8
$1N8280: length 3
  Top Layer w0.254: 11.91,21.56 11.91,21.55 12.31,21.15 13.93,21.15 14.06,21.27 14.06,21.82 14.08,21.84
$1N8313: length 2.8
  Top Layer w0.254: 14.06,20.18 14.06,20.55 14.39,20.88 16.07,20.88 16.27,20.68
$1N8402: length 5.8
  Top Layer w0.254: 13.44,21.91 12.88,21.91 12.57,22.22 11.45,22.22 11.1,21.87 11.1,19.83 11.89,19.04
$1N8538: length 2.8
  Top Layer w0.254: 11.78,18.16 13.09,16.85 13.09,15.93

## Copper pours and planes (outline as drawn; the poured copper is in the pictures)
GND on Top Layer: -2.53,33.76 41.93,33.76 41.93,-2.14 -2.53,-2.14
GND on Bottom Layer: -2.85,34.09 42.58,34.09 42.58,-2.36 -2.85,-2.36

## Text on the board
Bottom Silkscreen Layer: PA13 | PA12 | PA11 | github | Designed by / @NotCocoFish
Top Silkscreen Layer: GND | 3V3 | PA10 | PA9 | PB15 | PA8 | PB14 | PB13 | PB12 | PB1 | PB0 | PA7 | PA6 | PA5 | PA4 | PA3 | VBUS | PB3 | PA15 | PB5 | PB4 | PB6 | PWB | PB7 | PB8 | PB9 | PC15 | PC14 | RST | PA0 | PA1 | PA2 | DTR | RTS | STM32 Mini Dev V0.2 | SQC & CYX's / First Month / Anniversary
